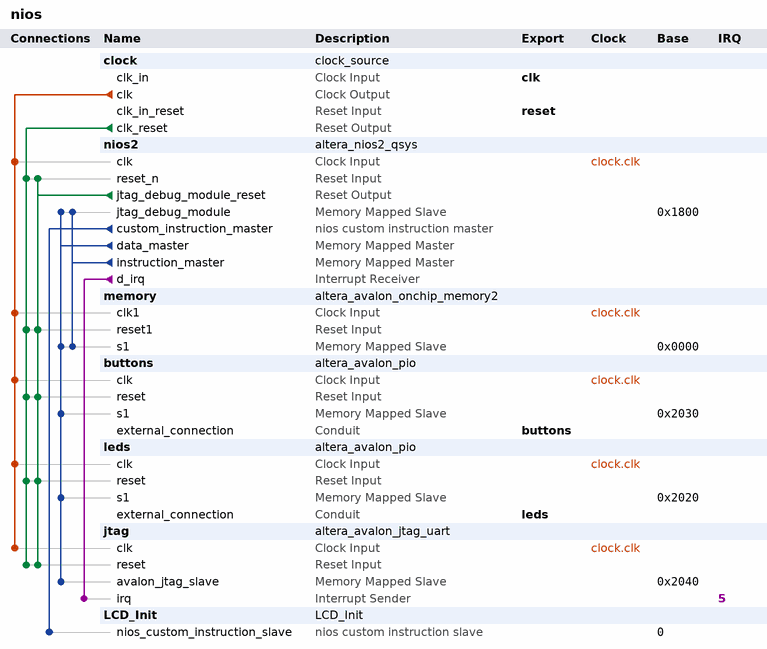
[diagram p0: system contents]
# Platform Designer (Qsys) system nios, Cyclone III EP3C25F324C8
# Parameters at their usual value, and those the tool derives, are not listed.
package require -exact qsys 13.1
create_system nios
set_project_property DEVICE_FAMILY {Cyclone III}
set_project_property DEVICE EP3C25F324C8

add_instance clock clock_source 13.1
set_instance_parameter_value clock clockFrequency 50000000

add_instance nios2 altera_nios2_qsys 13.1
set_instance_parameter_value nios2 resetSlave memory.s1
set_instance_parameter_value nios2 mmu_TLBMissExcSlave None
set_instance_parameter_value nios2 exceptionSlave memory.s1
set_instance_parameter_value nios2 breakSlave nios2.jtag_debug_module
set_instance_parameter_value nios2 impl Fast
set_instance_parameter_value nios2 icache_size 4096

add_instance memory altera_avalon_onchip_memory2 13.1
set_instance_parameter_value memory dataWidth 32
set_instance_parameter_value memory dualPort false
set_instance_parameter_value memory initMemContent true
set_instance_parameter_value memory initializationFileName onchip_mem.hex
set_instance_parameter_value memory memorySize 4096

add_instance buttons altera_avalon_pio 13.1
set_instance_parameter_value buttons direction Input
set_instance_parameter_value buttons width 2

add_instance leds altera_avalon_pio 13.1
set_instance_parameter_value leds direction Output
set_instance_parameter_value leds width 5

add_instance jtag altera_avalon_jtag_uart 13.1
set_instance_parameter_value jtag simInteractiveOptions NO_INTERACTIVE_WINDOWS

add_instance LCD_Init LCD_Init 1.0

# connections
add_connection clock.clk buttons.clk clock
add_connection clock.clk jtag.clk clock
add_connection clock.clk leds.clk clock
add_connection clock.clk memory.clk1 clock
add_connection clock.clk nios2.clk clock
add_connection clock.clk_reset buttons.reset reset
add_connection clock.clk_reset jtag.reset reset
add_connection clock.clk_reset leds.reset reset
add_connection clock.clk_reset memory.reset1 reset
add_connection clock.clk_reset nios2.reset_n reset
add_connection nios2.jtag_debug_module_reset buttons.reset reset
add_connection nios2.jtag_debug_module_reset jtag.reset reset
add_connection nios2.jtag_debug_module_reset leds.reset reset
add_connection nios2.jtag_debug_module_reset memory.reset1 reset
add_connection nios2.jtag_debug_module_reset nios2.reset_n reset
add_connection nios2.data_master buttons.s1 avalon
set_connection_parameter_value nios2.data_master/buttons.s1 baseAddress 0x2030
add_connection nios2.data_master jtag.avalon_jtag_slave avalon
set_connection_parameter_value nios2.data_master/jtag.avalon_jtag_slave baseAddress 0x2040
add_connection nios2.data_master leds.s1 avalon
set_connection_parameter_value nios2.data_master/leds.s1 baseAddress 0x2020
add_connection nios2.data_master memory.s1 avalon
set_connection_parameter_value nios2.data_master/memory.s1 baseAddress 0x0000
add_connection nios2.data_master nios2.jtag_debug_module avalon
set_connection_parameter_value nios2.data_master/nios2.jtag_debug_module baseAddress 0x1800
add_connection nios2.instruction_master memory.s1 avalon
set_connection_parameter_value nios2.instruction_master/memory.s1 baseAddress 0x0000
add_connection nios2.instruction_master nios2.jtag_debug_module avalon
set_connection_parameter_value nios2.instruction_master/nios2.jtag_debug_module baseAddress 0x1800
add_connection nios2.d_irq jtag.irq interrupt
set_connection_parameter_value nios2.d_irq/jtag.irq irqNumber 5
add_connection nios2.custom_instruction_master LCD_Init.nios_custom_instruction_slave nios_custom_instruction
set_connection_parameter_value nios2.custom_instruction_master/LCD_Init.nios_custom_instruction_slave CIName lcd_init_0
set_connection_parameter_value nios2.custom_instruction_master/LCD_Init.nios_custom_instruction_slave baseAddress 0

# exported interfaces
add_interface clk clock sink
set_interface_property clk EXPORT_OF clock.clk_in
add_interface reset reset sink
set_interface_property reset EXPORT_OF clock.clk_in_reset
add_interface buttons conduit end
set_interface_property buttons EXPORT_OF buttons.external_connection
add_interface leds conduit end
set_interface_property leds EXPORT_OF leds.external_connection

set_interconnect_requirement {$system} qsys_mm.clockCrossingAdapter HANDSHAKE
set_interconnect_requirement {$system} qsys_mm.maxAdditionalLatency 1
set_interconnect_requirement {$system} qsys_mm.insertDefaultSlave false

save_system nios.qsys
